# Altium project QSTL_MicroDSUB_FFC.PrjPcb
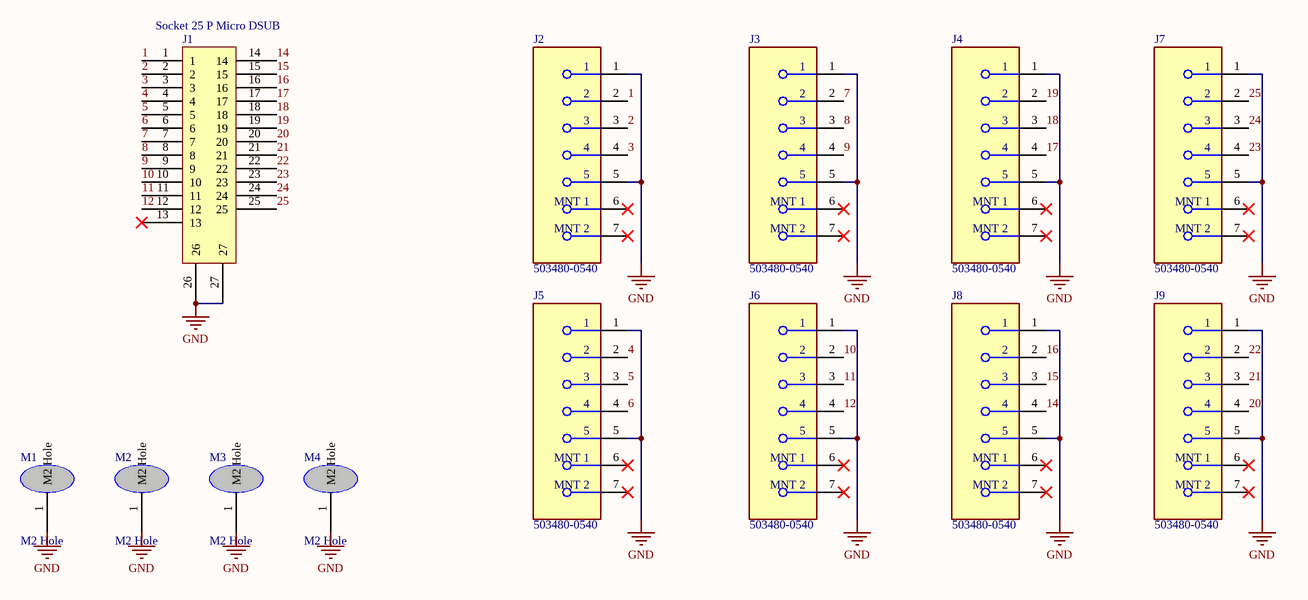
[diagram p0: QSTL_MicroDSUB_FFC.SchDoc]
1 sheet, 13 parts. Net scope: global (net labels, ports and power ports of the same name join across sheets).
Board file: QSTL_MicroDSUB_FFC.PcbDoc

## Sheet QSTL_MicroDSUB_FFC.SchDoc
size A4; SheetNumber: 1; SheetTotal: 1

### Parts
J1  Socket 25 P Micro DSUB  [581-M25-213L461]
J2  503480-0540  [FP-503480-0540-MFG]
J3  503480-0540  [FP-503480-0540-MFG]
J4  503480-0540  [FP-503480-0540-MFG]
J5  503480-0540  [FP-503480-0540-MFG]
J6  503480-0540  [FP-503480-0540-MFG]
J7  503480-0540  [FP-503480-0540-MFG]
J8  503480-0540  [FP-503480-0540-MFG]
J9  503480-0540  [FP-503480-0540-MFG]
M1  M2 Hole  [M2_Hole]
M2  M2 Hole  [M2_Hole]
M3  M2 Hole  [M2_Hole]
M4  M2 Hole  [M2_Hole]

### Nets
GND: J1.26 J1.27 J2.1 J2.5 J3.1 J3.5 J4.1 J4.5 J5.1 J5.5 J6.1 J6.5 J7.1 J7.5 J8.1 J8.5 J9.1 J9.5 M1.1(M2_Hole) M2.1(M2_Hole) M3.1(M2_Hole) M4.1(M2_Hole)
1: J1.1 J2.2
2: J1.2 J2.3
3: J1.3 J2.4
4: J1.4 J5.2
5: J1.5 J5.3
6: J1.6 J5.4
7: J1.7 J3.2
8: J1.8 J3.3
9: J1.9 J3.4
10: J1.10 J6.2
11: J1.11 J6.3
12: J1.12 J6.4
14: J1.14 J8.4
15: J1.15 J8.3
16: J1.16 J8.2
17: J1.17 J4.4
18: J1.18 J4.3
19: J1.19 J4.2
20: J1.20 J9.4
21: J1.21 J9.3
22: J1.22 J9.2
23: J1.23 J7.4
24: J1.24 J7.3
25: J1.25 J7.2

Not connected (* = marked no-connect by the designer): J1 13*; J2 6(MNT_1)* 7(MNT_2)*; J3 6(MNT_1)* 7(MNT_2)*; J4 6(MNT_1)* 7(MNT_2)*; J5 6(MNT_1)* 7(MNT_2)*; J6 6(MNT_1)* 7(MNT_2)*; J7 6(MNT_1)* 7(MNT_2)*; J8 6(MNT_1)* 7(MNT_2)*; J9 6(MNT_1)* 7(MNT_2)*

### Library data of the parts
J1 = 581-M25-213L461
J2-J9 = CMP-00257-52963780-1: 503480-0540 Connector FFC/FPC SKT 5 Position 0.5mm Solder Right Angle Surface Mount T/R; Manufacturer Lifecycle Status: ACTIVE; Actuator Material: Glass, Nylon, Polyamide; Number of Positions: 5; Pitch: 508µm; Plating: Gold; Voltage Rating: 50V; Current Rating: 500mA; Wire/Cable Type: Straight; Contact Plating: Gold; Termination: Solder; Country of Origin: KR; Number of Rows: 1; RoHS: Compliant; NexarPartId: 52963780; Max Operating Temperature: 85°C; Lifecycle Status: Production; Mount: Surface Mount; Halogen Free: Low Halogen; Height: 2.07mm; Housing Material: Polymer; Number of Circuits: 5; Number of Contacts: 5; Min Operating Temperature: -40°C; Flammability Rating: UL94 V-0; Contact Material: Bronze, Gold, Nickel; Orientation: Right Angle
M1-M4 = M2_HOLE